# Altium schematic sheet Controller Peripheral Iso.SchDoc
size A4; SheetNumber: 4; SheetTotal: 8
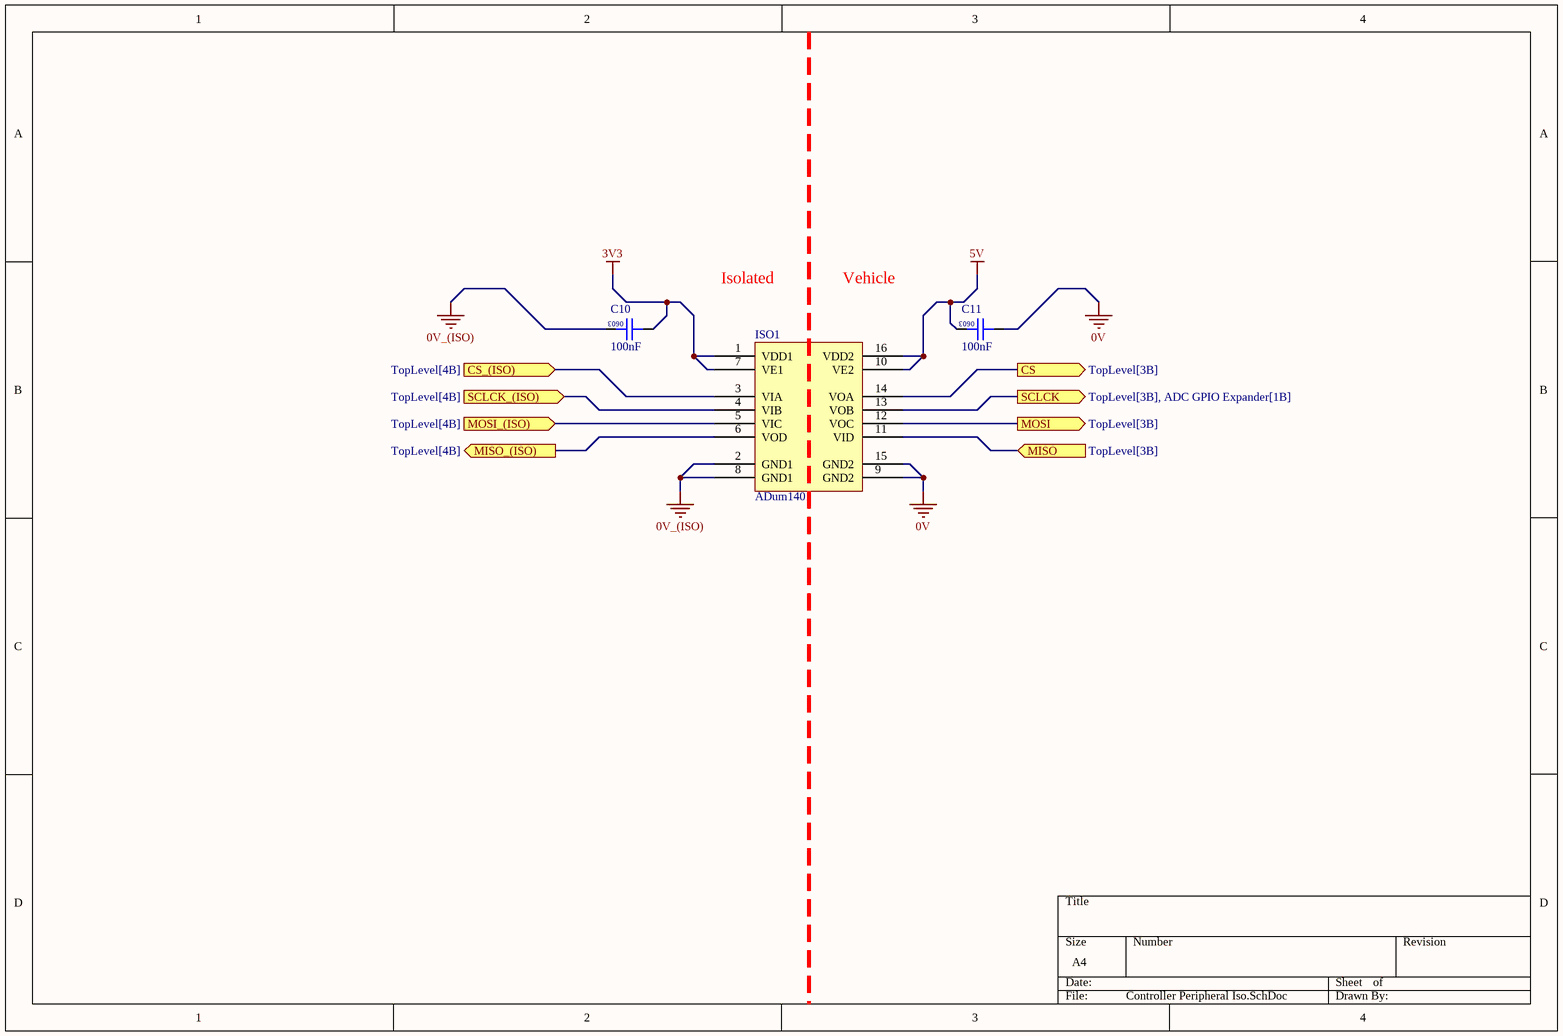
[diagram p0: Controller Peripheral Iso.SchDoc]

## Parts
C10  100nF  [0603]
C11  100nF  [0603]
ISO1  ADum1401  [AD 16-SOIC]

## Ports
CS (out, see TopLevel[3B]), CS_(ISO) (in, see TopLevel[4B]), MISO (in, see TopLevel[3B]), MISO_(ISO) (out, see TopLevel[4B]), MOSI (out, see TopLevel[3B]), MOSI_(ISO) (in, see TopLevel[4B]), SCLCK (out, see TopLevel[3B], ADC GPIO Expander[1B]), SCLCK_(ISO) (in, see TopLevel[4B])

## Nets
0V: C11.1 ISO1.9(GND2) ISO1.15(GND2)
0V_(ISO): C10.2 ISO1.2(GND1) ISO1.8(GND1)
3V3: C10.1 ISO1.1(VDD1) ISO1.7(VE1)
5V: C11.2 ISO1.10(VE2) ISO1.16(VDD2)
CS: ISO1.14(VOA) ; port CS
CS_(ISO): ISO1.3(VIA) ; port CS_(ISO)
MISO: ISO1.11(VID) ; port MISO
MISO_(ISO): ISO1.6(VOD) ; port MISO_(ISO)
MOSI: ISO1.12(VOC) ; port MOSI
MOSI_(ISO): ISO1.5(VIC) ; port MOSI_(ISO)
SCLCK: ISO1.13(VOB) ; port SCLCK
SCLCK_(ISO): ISO1.4(VIB) ; port SCLCK_(ISO)

## Notes on the sheet
- Isolated
- Vehicle
- (in symbol GCM188L81H104KA57D) 0603

## Library data of the parts
C10 C11 = GCM188L81H104KA57D: Manufacturer: muRata; Rated Voltage: 50V; Tolerance: ±10%; Material: MLCC; Temperature Rating: X8L; Part Number: GCM188L81H104KA57D; Value: 100nF; Digikey Part Number: 490-6049-1-ND
ISO1 = ADuM1401: General Purpose Digital Isolator 2500Vrms 4 Channel 1Mbps 25kV/µs CMTI 16-SOIC (0.295", 7.50mm Width); Manufacturer: Analog Devices; Complex IC: 0; Part Number: ADuM1401